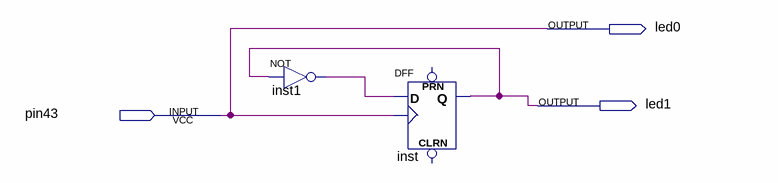
[diagram p0: schematic sheet]
// Quartus schematic ex3frequencydivider.bdf as structural Verilog: 2 symbols, 3 pins
module ex3frequencydivider (
  input  pin43,
  output led0,
  output led1
);

  wire inst1_out;

  not inst1 (inst1_out, led1);
  DFF inst (.CLK(pin43), .D(inst1_out), .Q(led1));  // open: CLRN, PRN

  assign led0 = pin43;
endmodule
